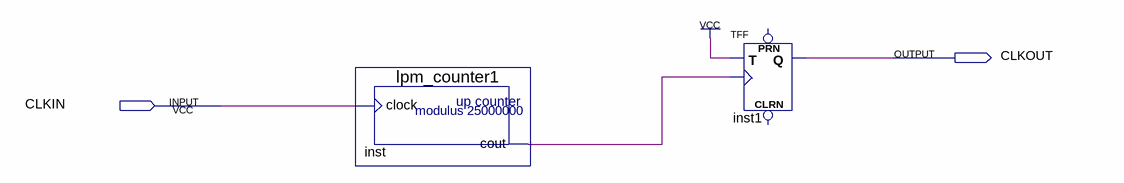
[diagram p0: schematic sheet]
// Quartus schematic divisor_de_clock.bdf as structural Verilog: 2 symbols, 2 pins
module divisor_de_clock (
  input  CLKIN,
  output CLKOUT
);

  wire inst_cout;

  lpm_counter1 inst (.clock(CLKIN), .cout(inst_cout));
  TFF inst1 (.T(1'b1), .CLK(inst_cout), .Q(CLKOUT));  // open: PRN, CLRN
endmodule
